# Altium schematic sheet ProxSensorType2_Transmit.SchDoc
size A4; SheetNumber: 2; SheetTotal: 3
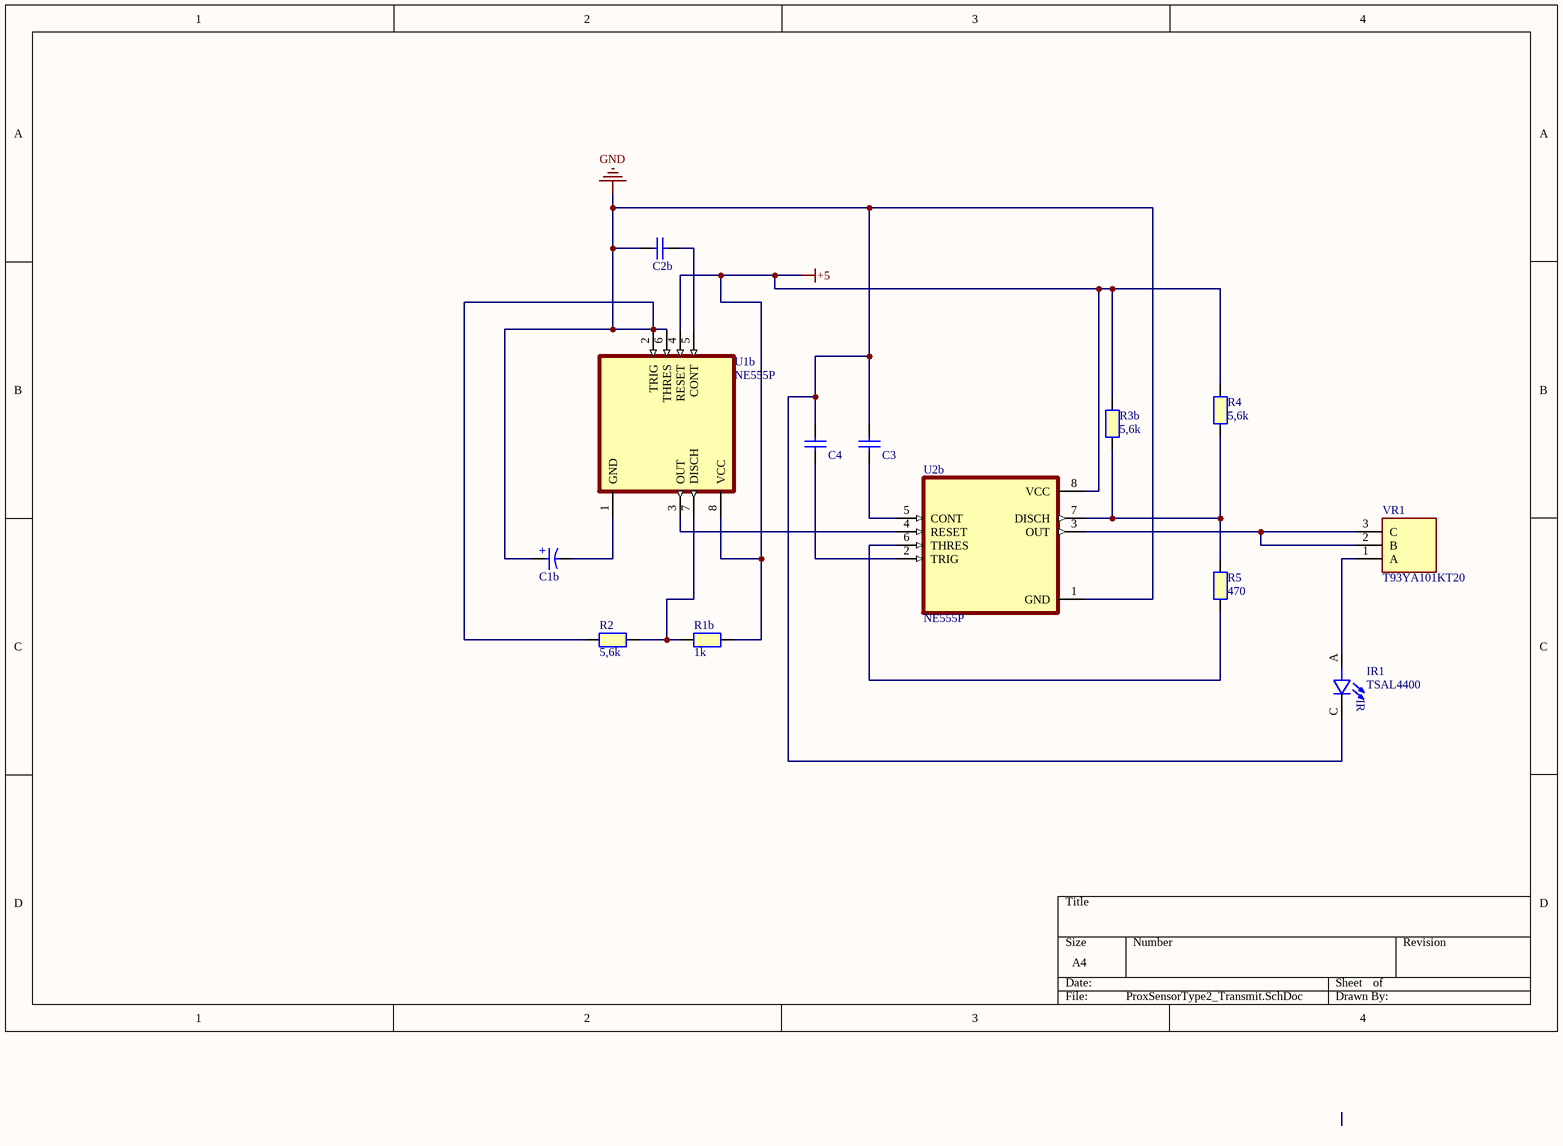
[diagram p0: ProxSensorType2_Transmit.SchDoc]

## Parts
C1b  1µF  [WCAP-ATG8_D5H11]  (value not drawn)
C2b  0,01uF  [WCAP-CSGP_0805_L2W1.25H0.8_Wave]  (value not drawn)
C3  0,01uF  [WCAP-CSGP_0805_L2W1.25H0.8_Wave]  (value not drawn)
C4  0,01uF  [WCAP-CSGP_0805_L2W1.25H0.8_Wave]  (value not drawn)
IR1  TSAL4400  [LEDRD254W45D335H610]
R1b  1k  [RESC2012X50N]
R2  5,6k  [RESC2012X50N]
R3b  5,6k  [RESC2012X50N]
R4  5,6k  [RESC2012X50N]
R5  470  [RESC2012X50N]
U1b  NE555P  [DIP794W45P254L959H508Q8]
U2b  NE555P  [DIP794W45P254L959H508Q8]
VR1  T93YA101KT20  [T93YA5K10]

## Nets
+5: R1b.2 R3b.2 R4.2 U1b.4(RESET) U1b.8(VCC) U2b.8(VCC)
GND: C1b.1(P) C2b.1 C3.2 C4.2 IR1.C R2.1 U1b.2(TRIG) U1b.6(THRES) U2b.1(GND)
NetC1b_2: C1b.2(N) U1b.1(GND)
NetC2b_2: C2b.2 U1b.5(CONT)
NetC3_1: C3.1 U2b.5(CONT)
NetC4_1: C4.1 U2b.2(TRIG)
NetIR1_A: IR1.A VR1.1(A)
NetR1b_1: R1b.1 R2.2 U1b.7(DISCH)
NetR3b_1: R3b.1 R4.1 R5.2 U2b.7(DISCH)
NetR5_1: R5.1 U2b.6(THRES)
NetU1b_3: U1b.3(OUT) U2b.4(RESET)
NetU2b_3: U2b.3(OUT) VR1.2(B) VR1.3(C)

## Notes on the sheet
- (in symbol 860010272005) +
- (in symbol TSAL4400) IR

## Library data of the parts
C1b = 860010272005: WCAP-ATG8 Aluminum Electrolytic Capacitor, Radial, THT, D5 x H11mm, 100µF, 10V; Manufacturer: Wurth Elektronik; Capacitance Tolerance: +/-20%; Dissipation Factor: 19%; Endurance: 2000h; Leakage Current: 10µA; Ripple Current: 198mA; Technical Reference: ATBC110101M010DSPA3B000; Manufacturer Part Number: 860010272005; Category: Aluminum Electrolytic Capacitors; Match Code: WCAP-ATG8; ComponentLink1Description: Website Link; ComponentLink1URL: https://www.we-online.com/redexpert/article/860010272005?ad; ComponentLink2Description: Datasheet Link; ComponentLink2URL: https://www.we-online.com/redexpert/spec/860010272005?ad; Mount: Through Hole; Operating Temperature Max: 85°C; Operating Temperature Min: -40°C; Packaging: Ammo Pack; Height: 11mm; Diameter: 5mm; Capacitance: 100µF; Rated Voltage (DC): 10V
C2b C3 C4 = 885012004008: WCAP-CSGP Multilayer Ceramic Chip Capacitor, General Purpose, size 0201, NP0 Class I, 22pF, 25VDC; Manufacturer: Wurth Elektronik; Case/Size Code: 0201; Capacitance Tolerance: +/-5%; Insulation Resistance: 10GΩ; Q Factor: 840; Rated Voltage (DC): 25V; Technical Reference: NP00201220J025DFCT10000; Manufacturer Part Number: 885012004008; Category: Multilayer Ceramic Chip Capacitors; Match Code: WCAP-CSGP; ComponentLink1Description: Website Link; ComponentLink1URL: https://www.we-online.com/redexpert/article/885012004008?ad; ComponentLink2Description: Datasheet Link; ComponentLink2URL: https://www.we-online.com/redexpert/spec/885012004008?ad; Mount: Surface Mount; Operating Temperature Max: 125°C; Operating Temperature Min: -55°C; Packaging: Tape and Reel; Length: 0.6mm; Width: 0.3mm; Height: 0.3mm; Capacitance: 22pF; Ceramic Type: NP0 Class I
IR1 = TSAL4400: Infrared Emitter 940nm 36mW/sr Circular Top Mount 2-Pin T-1 Bulk; MF: Vishay Semiconductor; Package: Radial Vishay; Price: None; SnapEDA_Link: https://www.snapeda.com/parts/TSAL4400/Vishay%20Semiconductor%20Opto%20Division/view-part/3623381/?ref=snap; Value: *; MP: TSAL4400; Availability: Unavailable
R1b R2 R3b R4 R5 = RESISTOR 0805: 4,7k Resistor 0805; Part Number: TNPW080510K0BETA; Manufacturer: Vishay Dale
VR1 = T93YA101KT20: 100, Through Hole Trimmer Potentiometer 0.5W Top Adjust Vishay, T93; Geometry.Height: 9mm; Mouser Part Number: 72-T93YA-100; Mouser Price/Stock: https://www.mouser.co.uk/ProductDetail/Vishay-Sfernice/T93YA101KT20?qs=iVq8I%252Bwveq19HOEubYKU9A%3D%3D; Manufacturer_Name: Vishay; Manufacturer_Part_Number: T93YA101KT20; Datasheet Link: https://www.vishay.com/docs/51026/t93.pdf
U1b U2b = NE555P: Package: None; Price: None; Value: *; MP: NE555P; Availability: Unavailable